# EAGLE design 312_lora_rak811 (EAGLE 9.6.2)
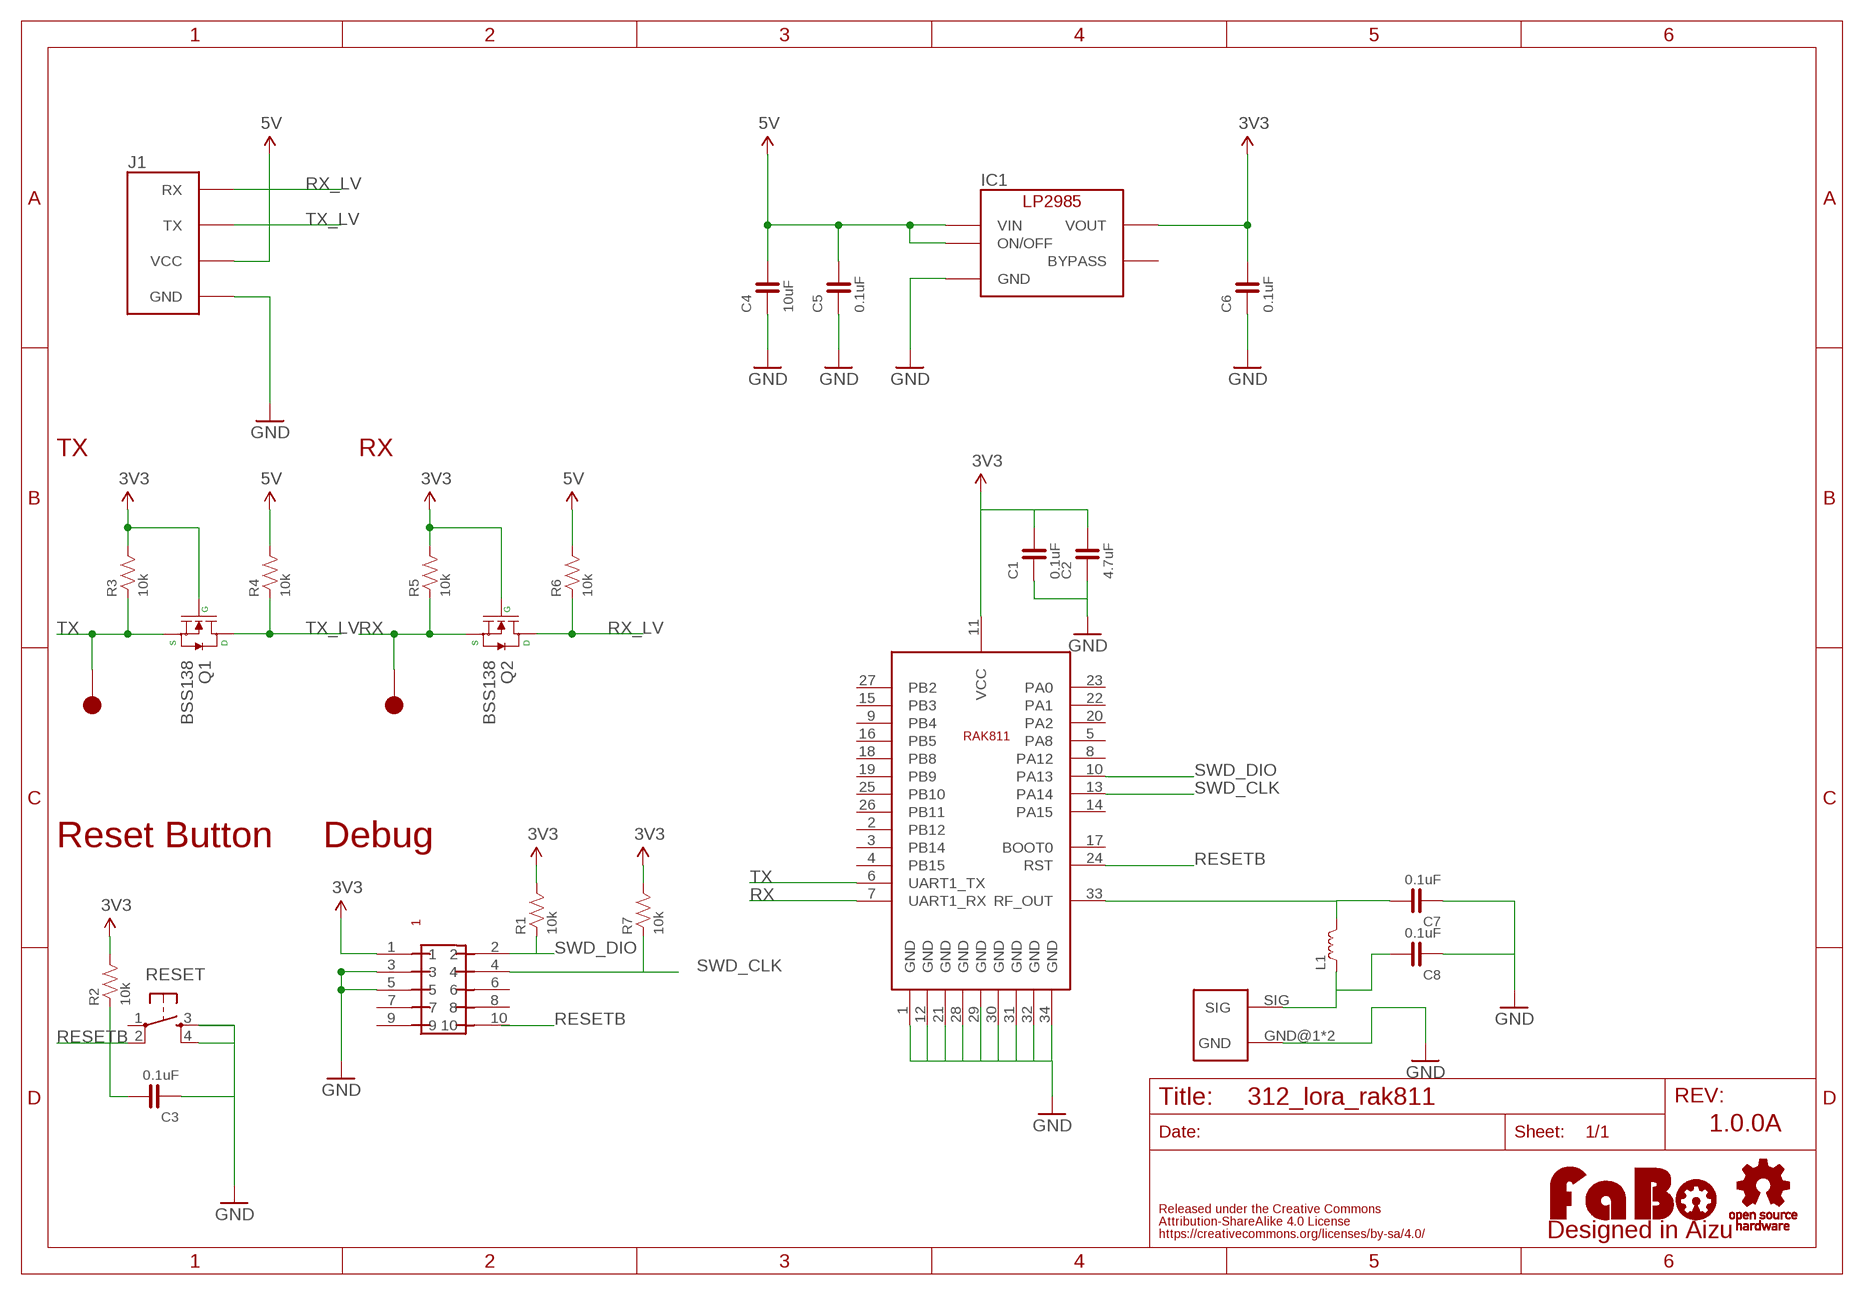
[diagram p0: schematic, sheet 1]

## Parts
C1  0.1uF  CAPACITOR-0603_NARROW  [0603-NARROW]
C2  4.7uF  CAPACITOR-0603_NARROW  [0603-NARROW]
C3  0.1uF  CAPACITOR-0603_NARROW  [0603-NARROW]
C4  10uF  CAPACITOR-0603_NARROW  [0603-NARROW]
C5  0.1uF  CAPACITOR-0603_NARROW  [0603-NARROW]
C6  0.1uF  CAPACITOR-0603_NARROW  [0603-NARROW]
C7  0.1uF  CAPACITOR-0603_NARROW  [0603-NARROW]
C8  0.1uF  CAPACITOR-0603_NARROW  [0603-NARROW]
IC1  LP2985-33DBV  [SOT-23-5]
J1  FABO_BRICK_SERIAL-LONGER  [FABO_BRICK_SERIAL_LONGER]
L1  COIL-0603  [0603]
LOGO1  LOGO_FABO-M_BOTTOM  [LOGO_FABO_M_BOTTOM]
Q1  BSS138  MOSFET-N  [SOT23-3]
Q2  BSS138  MOSFET-N  [SOT23-3]
R1  10k  RESISTOR-0603-NARROW  [0603-NARROW]
R2  10k  RESISTOR-0603-NARROW  [0603-NARROW]
R3  10k  RESISTOR-0603-NARROW  [0603-NARROW]
R4  10k  RESISTOR-0603-NARROW  [0603-NARROW]
R5  10k  RESISTOR-0603-NARROW  [0603-NARROW]
R6  10k  RESISTOR-0603-NARROW  [0603-NARROW]
R7  10k  RESISTOR-0603-NARROW  [0603-NARROW]
RESET  TACT-SWITCH-SMD_KMR2  [KMR2]
TP10  TP-15  [TP-15]
TP11  TP-15  [TP-15]
U$2  RAK811  [RAK811]
U$3  LOGO_OSHW-M_BOTTOM  [LOGO_OSHW_M_BOTTOM]
U$8  PIN-HEADER-SMT(1.27MM)2X5  [PIN-HEADER-SMT(1.27MM)2X5]
UF1  HIROSE-U.FL  [HIROSE-UF.L]

## Nets
3V3: C1.2 C2.2 C6.2 IC1.5(VOUT) Q1.1(G) Q2.1(G) R1.2 R2.2 R3.2 R5.2 R7.2 U$2.11(VCC) U$8.1
5V: C4.2 C5.2 IC1.1(VIN) IC1.3(ON/OFF) J1.VCC R4.2 R6.2
GND: C1.1 C2.1 C3.1 C4.1 C5.1 C6.1 C7.1 C8.1 IC1.2(GND) J1.GND RESET.3 RESET.4 U$2.1(GND) U$2.12(GND) U$2.21(GND) U$2.28(GND) U$2.30(GND) U$2.31(GND) U$2.32(GND) U$2.34(GND) U$8.3 U$8.5 UF1.GND@1(GND) UF1.GND@2(GND)
N$2: C7.2 L1.2 U$2.33(RF_OUT)
N$3: C8.2 L1.1 UF1.SIG
RESETB: C3.2 R2.1 RESET.2 U$2.24(RST) U$8.10
RX: Q2.2(S) R5.1 TP10.1 U$2.7(UART1_RX)
RX_LV: J1.RX Q2.3(D) R6.1
SWD_CLK: R7.1 U$2.13(PA14) U$8.4
SWD_DIO: R1.1 U$2.10(PA13) U$8.2
TX: Q1.2(S) R3.1 TP11.1 U$2.6(UART1_TX)
TX_LV: J1.TX Q1.3(D) R4.1
Unconnected: IC1.4(BYPASS) RESET.1 U$2.2(PB12) U$2.3(PB14) U$2.4(PB15) U$2.5(PA8) U$2.8(PA12) U$2.9(PB4) U$2.14(PA15) U$2.15(PB3) U$2.16(PB5) U$2.17(BOOT0) U$2.18(PB8) U$2.19(PB9) U$2.20(PA2) U$2.22(PA1) U$2.23(PA0) U$2.25(PB10) U$2.26(PB11) U$2.27(PB2) U$2.29(GND) U$8.6 U$8.7 U$8.8 U$8.9

## Notes on the sheet
- TX | RX
- Reset Button | Debug
- 1.0.0A

## Library data of the parts
C1-C8 = FaBo-Capacitor:CAPACITOR: CAPACITOR
IC1 = FaBo-Supply:LP2985: LP2985
J1 = FaBo-Template:FABO_BRICK_SERIAL: FaBo Brick Serial
L1 = FaBo-Coil:COIL: RESISTOR
LOGO1 = component:LOGO_FABO
Q1 Q2 = FaBo-etc:MOSFET-N
R1-R7 = FaBo-Resistors:RESISTOR: RESISTOR
RESET = FaBo-Switch:TACT-SWITCH
TP10 TP11 = FaBo-Supply:TP
U$2 = FaBo-LoRa:RAK811
U$3 = component:LOGO_OSHW
U$8 = GClue:PIN-HEADER-SMT(1.27MM)2X5: PIN-HEADER-SMT (1.27MM) 2x5
UF1 = FaBo-Connetor:HIROSE-U.FL

## Board
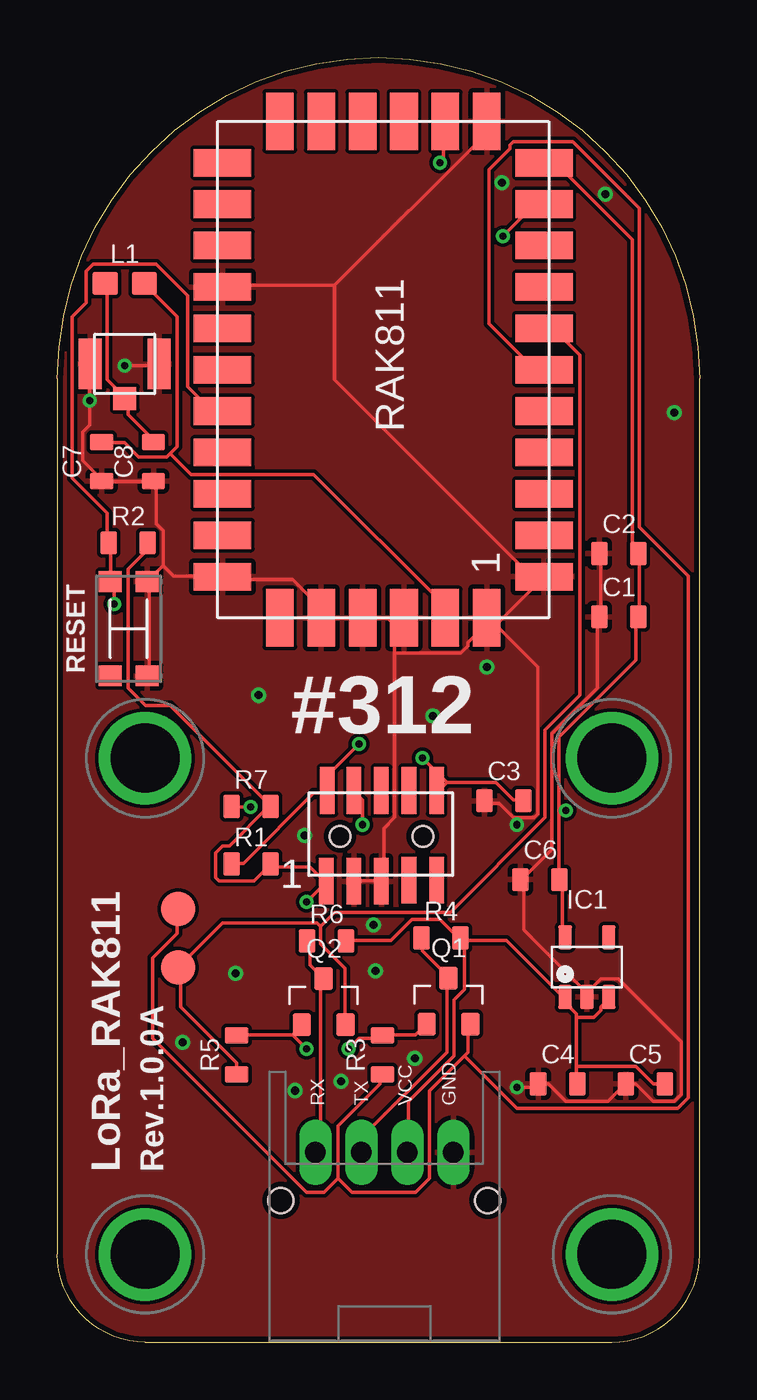
[diagram p1: board, top side]
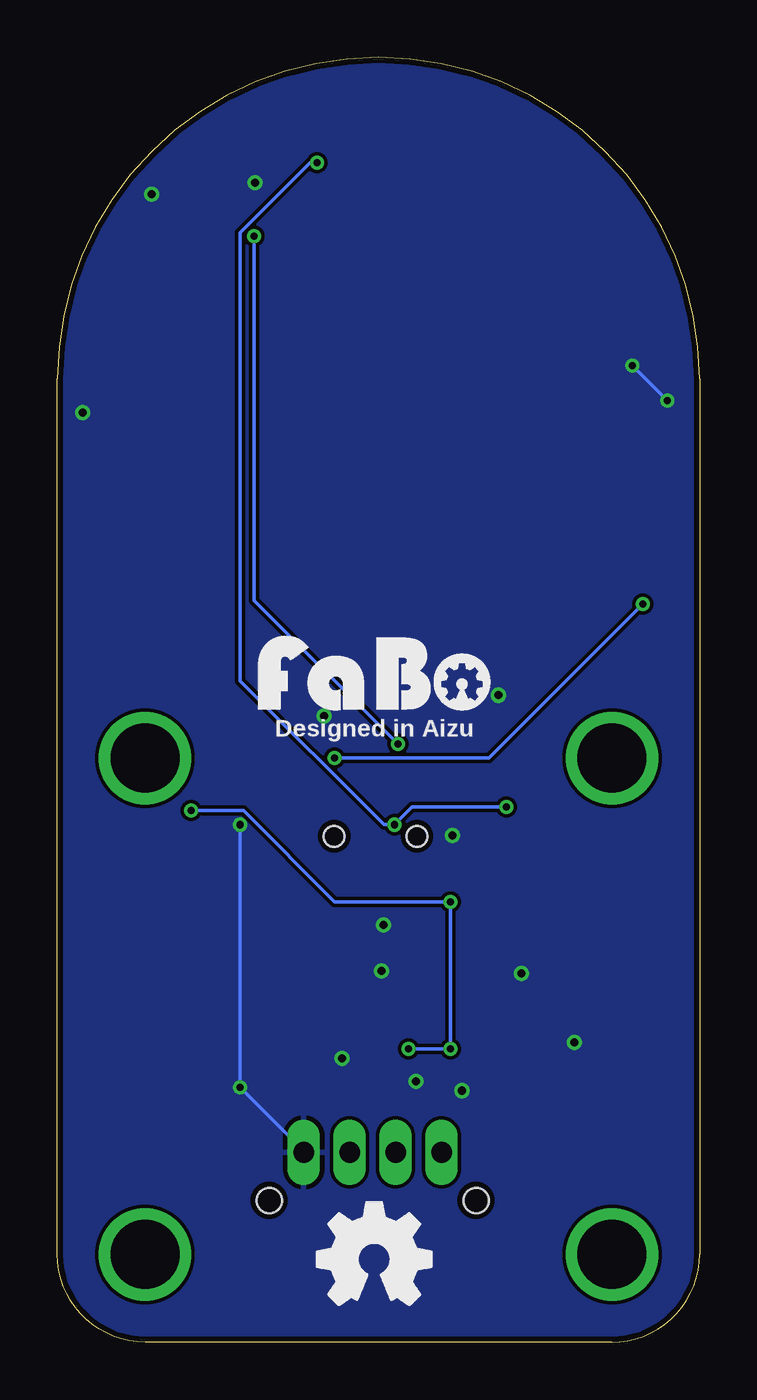
[diagram p2: board, bottom side, seen from below]

Size 27.94 x 55.88 mm. Coordinates in mm from the lower left corner, seen from the top.
Copper layers (1*16): Top 0.035mm / dielectric 1.6mm / Bottom 0.035mm
Design rules "PCBway": minimum track width 6mil, minimum drill 12mil, track to track 6mil, track to pad 6mil, pad to pad 6mil, via to via 6mil, smd to smd 6mil, copper to edge 10mil, drill to drill 10mil, minimum pad ring 10mil, minimum via ring 6mil, stop-mask expansion 2mil, vias tented up to drill 100mil, thermal gap 8mil

### Footprints (pad centres in the part's own frame; a part is rotated, then mirrored left to right if it is on the bottom)
0603-NARROW = smd 0.71 x 1: 1 -0.85,0; 2 0.85,0
SOT-23-5 = smd 0.6 x 1.05: 1 -0.95,-1.3; 2 0,-1.3; 3 0.95,-1.3; 4 0.95,1.3; 5 -0.95,1.3
FABO_BRICK_SERIAL_LONGER = drill 0.9 pad 1.422 long: GND 3.254,-17.145; RX -2.746,-17.145; TX -0.746,-17.145; VCC 1.254,-17.145 | drill 3 pad 3.81: P$5 -10.16,0; P$6 10.16,0; P$7 -10.16,-21.59; P$8 10.16,-21.59 | hole 1.1: -4.246,-19.245; 4.754,-19.245
0603 = smd 1.1 x 1: 1 -0.85,0; 2 0.85,0
SOT23-3 = smd 0.8 x 1: 1 -0.95,-1; 2 0.95,-1; 3 0,1
KMR2 = smd 0.9 x 1: 1 -2.05,0.8; 2 2.05,0.8; 3 2.05,-0.8; 4 -2.05,-0.8
TP-15 = smd 1.5 x 1.5: 1 0,0
RAK811 = smd 1.2 x 2.5: 1 -9,-7; 2 -7.2,-7; 3 -5.4,-7; 4 -3.6,-7; 5 -1.8,-7; 6 0,-7; 7 1.8,-7; 8 3.6,-7; 9 5.4,-7; 10 7.2,-7; 11 9,-7; 18 9,7; 19 7.2,7; 20 5.4,7; 21 3.6,7; 22 1.8,7; 23 0,7; 24 -1.8,7; 25 -3.6,7; 26 -5.4,7; 27 -7.2,7; 28 -9,7 | smd 2.5 x 1.2: 12 10.8,-4.5; 13 10.8,-2.7; 14 10.8,-0.9; 15 10.8,0.9; 16 10.8,2.7; 17 10.8,4.5; 29 -10.8,4.5; 30 -10.8,2.7; 31 -10.8,0.9; 32 -10.8,-0.9; 33 -10.8,-2.7; 34 -10.8,-4.5
PIN-HEADER-SMT(1.27MM)2X5 = smd 0.635 x 2.032: 1 -2.4,-1.95; 2 -2.35,2; 3 -1.2,-1.95; 4 -1.2,2; 5 0,-1.95; 6 0,2; 7 1.2,-1.9; 8 1.2,2; 9 2.4,-1.9; 10 2.4,2 | hole 0.9: 1.8,0; -1.8,0
HIROSE-UF.L = smd 1 x 2.2: GND@1 -1.5,0; GND@2 1.5,0 | smd 1 x 1: SIG 0,-1.5

### Placement (x,y rotation side)
C1  24.43,31.55 0 top
C2  24.43,34.3 0 top
C3  19.43,23.55 0 top
C4  21.77,11.23 0 top
C5  25.58,11.23 0 top
C6  21,20.12 0 top
C7  1.93,38.3 90 top
C8  4.18,38.3 90 top
IC1  23.04,16.31 0 top
J1  13.97,25.4 0 top
L1  2.93,46.05 0 top
LOGO1  14.15,27.1 0 top
Q1  17.02,14.83 0 top
Q2  11.58,14.81 0 top
R1  8.43,20.8 0 top
R2  3.07,34.76 0 top
R3  14.15,12.5 90 top
R4  16.69,17.58 0 top
R5  7.8,12.5 90 top
R6  11.71,17.45 0 top
R7  8.43,23.3 0 top
RESET  3.1,31.03 90 top
TP10  5.26,16.31 0 top
TP11  5.26,18.85 0 top
U$2  14.18,42.3 90 top
U$3  14.15,3.61 0 top
U$8  14.1,22 0 top
UF1  2.93,42.55 0 top

### Tracks (layer width: path | path; a pad name or v marks a point on that pad's centre or on a via)
3V3  (via drill 0.3)
  Top 0.152: Q1.1 16.03,13.82 15.57,13.36 14.2,13.36 R3.2 14.05,13.21 13.13,13.21 v12.67,12.75 | 10.24,13.36 7.8,13.36 R5.2 | 10.24,13.36 10.54,13.66 Q2.1 | 10.24,13.36 v10.85,12.75 | R2.2 3.84,34.7 3.84,34.39 3.07,33.63 3.07,28.45 3.84,27.69 4.9,27.69 9.17,23.42 R7.2 9.17,23.27 7.49,21.59 7.19,21.59 6.88,21.28 6.88,20.22 7.04,20.07 8.56,20.07 9.17,20.68 R1.2 9.32,20.68 11,20.68 11.61,20.07 U$8.1 11.61,19.91 v10.85,19.15 | IC1.5 21.97,17.63 21.97,20.07 C6.2 21.82,20.22 21.82,23.11 | 21.82,23.11 21.82,26.31 25.17,29.67 25.17,31.5 C1.2 25.32,31.65 25.32,34.24 C2.2 25.17,34.39 25.02,34.54 25.02,47.95 21.82,51.16 21.21,51.16 U$2.11 | 21.82,23.11 v22.12,23.11
  Bottom 0.152: v12.67,12.75 v10.85,12.75 v10.85,19.15 15.87,19.15 19.84,23.11 v22.12,23.11
5V
  Top 0.152: R6.2 12.67,17.47 14.5,17.47 15.42,18.39 16.64,18.39 17.4,17.63 R4.2 | 22.58,14.12 22.58,14.27 21.97,14.88 IC1.1 21.97,15.04 19.53,17.47 17.7,17.47 | 22.58,14.12 22.58,11.99 | 22.58,11.99 22.58,11.23 C4.2 | C5.2 25.93,11.23 25.17,11.99 22.58,11.99 | 22.58,14.12 23.34,14.12 23.65,14.43 23.65,14.58 23.95,14.88 IC1.3 | 17.7,17.47 17.55,17.47 R4.2 | 17.7,17.47 17.7,15.34 17.25,14.88 17.25,12.45 15.27,10.46 15.27,8.33 J1.VCC | 17.7,17.47 R4.2
GND  (via drill 0.3, 0.35)
  Top 0.152: C2.1 23.65,34.24 23.65,31.65 C1.1 23.49,31.5 23.49,28.45 21.51,26.47 21.51,21.44 20.29,20.22 C6.1 20.29,20.07 20.29,17.93 23.04,15.19 | 23.04,15.19 IC1.2 23.04,15.04 | 23.04,15.19 23.65,15.8 24.41,15.8 27.15,13.06 27.15,10.77 26.85,10.46 25.93,10.46 25.17,11.23 C5.1 24.71,11.23 23.95,10.46 22.12,10.46 21.36,11.23 C4.1 20.9,11.23 20.75,11.07 v19.99,11.07 | 12.06,45.97 7.19,45.97 U$2.21 | 12.06,45.97 18.62,52.53 18.62,52.98 U$2.12 | RESET.4 3.99,29.06 3.99,33.02 RESET.3 3.99,33.17 4.6,33.78 | 4.6,33.78 4.6,35.31 4.29,35.61 4.29,37.44 C8.1 4.14,37.44 2.01,37.44 C7.1 1.85,37.59 1.09,38.35 1.09,39.57 1.4,39.88 v1.4,40.94 1.4,42.47 UF1.GND@1 | v2.92,42.47 4.29,42.47 UF1.GND@2 | 4.6,33.78 5.05,33.32 7.04,33.32 U$2.28 7.19,33.17 10.24,33.17 11.46,31.95 11.46,31.65 U$2.30 11.61,31.5 13.13,31.5 U$2.31 14.35,31.5 14.66,31.19 | 19.99,22.81 20.75,22.81 20.9,22.96 20.9,29.36 19.08,31.19 | 19.99,22.81 19.84,22.81 19.23,23.42 18.62,23.42 C3.1 | 19.08,31.19 18.77,31.5 U$2.34 | 19.08,31.19 20.9,33.02 | 20.9,33.02 21.06,33.17 U$2.1 20.9,33.02 | 19.08,31.19 U$2.34 | U$8.3 12.98,20.07 14.05,20.07 U$8.5 14.2,20.07 14.2,22.35 14.66,22.81 14.66,29.97 | 14.66,31.19 14.66,29.97 | 14.66,31.19 14.96,31.5 U$2.32 14.66,31.19 | 14.66,29.97 17.55,29.97 17.86,30.28 17.86,30.43 18.77,31.34 U$2.34 | 12.06,45.97 12.06,41.86 20.9,33.02 | 19.99,22.81 v19.99,22.5
  Bottom 0.152: J1.GND 17.25,8.33 v19.99,11.07 v19.99,22.5 | v1.4,40.94 v2.92,42.47
  other vias: 26.85,40.44 18.69,29.37 10.75,22.04 13.85,16.14 7.75,16.04 5.45,13.04 12.35,11.34 15.55,12.34 10.35,10.94 16.35,27.24 8.75,28.14 23.85,49.94 19.35,50.44 13.75,18.14
  pour Bottom: 0.18,-0.2 0.18,55.68 28.12,55.68 28.12,-0.2
  pour Top: 0.18,-0.2 0.18,55.68 26.85,55.68 28.12,55.68 28.12,-0.2
N$2
  Top 0.152: 4.9,38.66 5.21,38.96 5.21,44.6 3.84,45.97 L1.2 | 4.9,38.66 4.75,38.51 3.53,38.51 2.92,39.12 2.01,39.12 C7.2 | 4.9,38.66 5.82,37.74 11.15,37.74 16.79,32.11 16.79,31.65 U$2.33
N$3
  Top 0.152: C8.2 4.14,39.27 3.07,40.33 3.07,40.94 UF1.SIG 2.92,41.1 2.16,41.86 2.16,45.97 L1.1
RESETB  (via drill 0.3)
  Top 0.152: 16.94,24.33 19.08,24.33 19.84,23.57 20.14,23.57 C3.2 | 16.94,24.33 16.64,24.03 U$8.10 | U$2.24 7.04,40.64 6.58,40.64 5.66,41.55 5.66,45.52 4.29,46.89 1.55,46.89 1.24,46.58 1.24,45.21 0.63,44.6 0.63,37.59 2.16,36.07 2.16,34.85 R2.1 2.31,34.7 2.31,33.17 RESET.2 2.31,33.02 2.46,32.87 v2.46,32.11 | v15.87,25.4 16.94,24.33
  Bottom 0.152: v15.87,25.4 9.17,25.4 v2.46,32.11
RX
  Top 0.152: R5.1 7.8,12.14 5.36,14.58 5.36,16.26 TP10.1 7.19,18.24 11.3,18.24 11.46,18.08 | 11.46,18.08 11.46,17.32 12.52,16.26 12.52,13.82 Q2.2 | 11.46,18.08 12.06,18.69 17.09,18.69 21.21,22.81 21.21,26.62 22.73,28.14 22.73,42.93 21.67,43.99 21.21,43.99 U$2.7
RX_LV
  Top 0.152: R6.1 11,17.32 11,16.41 11.46,15.95 Q2.3 11.46,15.8 11.46,8.48 11.3,8.33 J1.RX
SWD_CLK  (via drill 0.3)
  Top 0.152: v8.41,23.27 7.65,23.27 R7.1 | v13.28,22.5 13.28,23.57 12.98,23.88 U$8.4 | v16.64,51.31 16.79,51.46 16.79,52.98 U$2.13
  Bottom 0.152: v8.41,23.27 12.52,23.27 v13.28,22.5 13.74,22.5 19.99,28.75 19.99,48.26 16.94,51.31 v16.64,51.31
SWD_DIO  (via drill 0.3)
  Top 0.152: R1.1 7.65,20.83 8.1,20.83 11.15,23.88 11.61,23.88 U$8.2 11.76,24.03 11.76,24.64 v13.13,26.01 | v19.38,48.11 20.75,49.48 21.06,49.48 U$2.10
  Bottom 0.152: v19.38,48.11 19.38,32.26 v13.13,26.01
TX
  Top 0.152: 12.22,7.11 12.22,9.4 14.05,11.23 14.05,11.53 R3.1 | 12.22,7.11 12.83,6.5 15.57,6.5 16.18,7.11 16.18,10.92 17.7,12.45 | 17.7,12.45 17.86,12.6 17.86,13.82 Q1.2 | 12.22,7.11 11.61,6.5 10.85,6.5 4.14,13.21 4.14,16.71 5.21,17.78 5.21,18.85 TP11.1 | 17.7,12.45 19.99,10.16 27,10.16 27.46,10.62 27.46,33.32 25.32,35.46 25.32,49.33 22.43,52.22 19.84,52.22 19.68,52.07 19.68,51.92 18.77,51 18.77,44.3 20.75,42.32 21.06,42.32 U$2.6
TX_LV
  Top 0.152: R4.1 15.87,17.47 15.87,17.02 16.94,15.95 Q1.3 16.94,15.8 16.94,12.6 13.28,8.94 13.28,8.33 J1.TX

### Text on the board
tPlace: #312 | LoRa_RAK811 | Rev.1.0.0A
bPlace: Designed in Aizu